# Altium schematic sheet Uart.SchDoc
size A
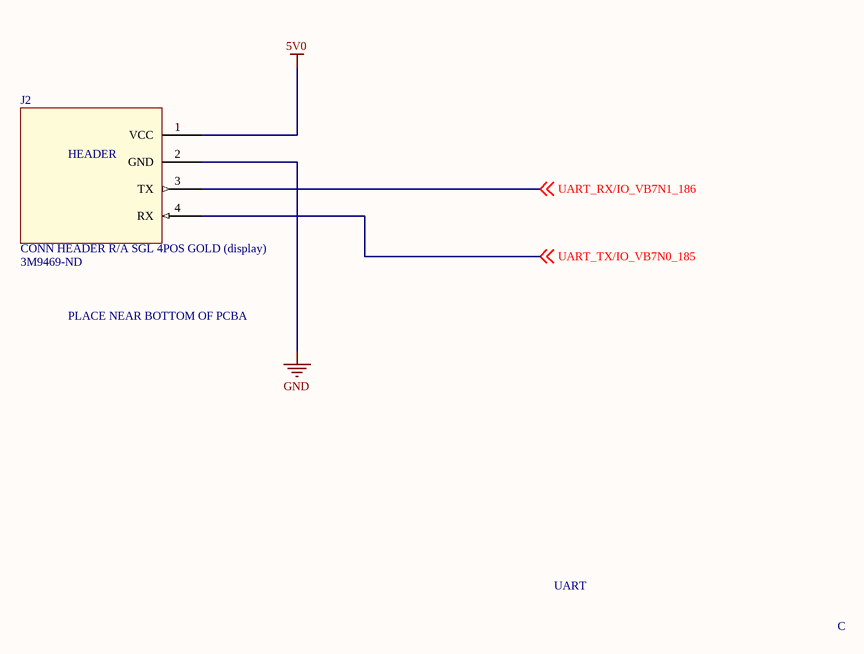
[diagram p0: Uart.SchDoc]

## Parts
J2  CONN HEADER R/A SGL 4POS GOLD (display)  Supplier Part Number 1: 3M9469-ND  [HEADER_4POS_UART]

## Nets
5V0: J2.1(VCC)
GND: J2.2(GND)
UART_RX/IO_VB7N1_186: J2.3(TX) ; off-sheet UART_RX/IO_VB7N1_186
UART_TX/IO_VB7N0_185: J2.4(RX) ; off-sheet UART_TX/IO_VB7N0_185

## Notes on the sheet
- PLACE NEAR BOTTOM OF PCBA
- UART
- C
- (in symbol CONN HEADER R/A SGL 4POS GOLD (display)) HEADER

## Library data of the parts
J2 = CONN HEADER R/A SGL 4POS GOLD (display): http://multimedia.3m.com/mws/media/548122O/3mtm-pin-strip-header-ts2182.pdf; Supplier 1: Digi-Key